# Altium schematic sheet USB_HUB.SchDoc: USB_HUB
size A3; Date: Not used; ApprovedBy: Not used; CheckedBy: Not used; Author: Not used; CompanyName: STMicroelectronics; DrawnBy: Not used; Engineer: Not used; Organization: Not used; Address1: Not used; Address2: Not used; Address3: Not used; Address4: Not used; DocumentNumber: Not used; Revision: Not used; SheetNumber: 12; SheetTotal: 18; CurrentTime: Not used; CurrentDate: Not used; Time: Not used; DocumentFullPathAndName: Not used; DocumentName: Not used; ModifiedDate: Not used; ImagePath: Not used; ProjectName: Not used; Application_BuildNumber: Not used
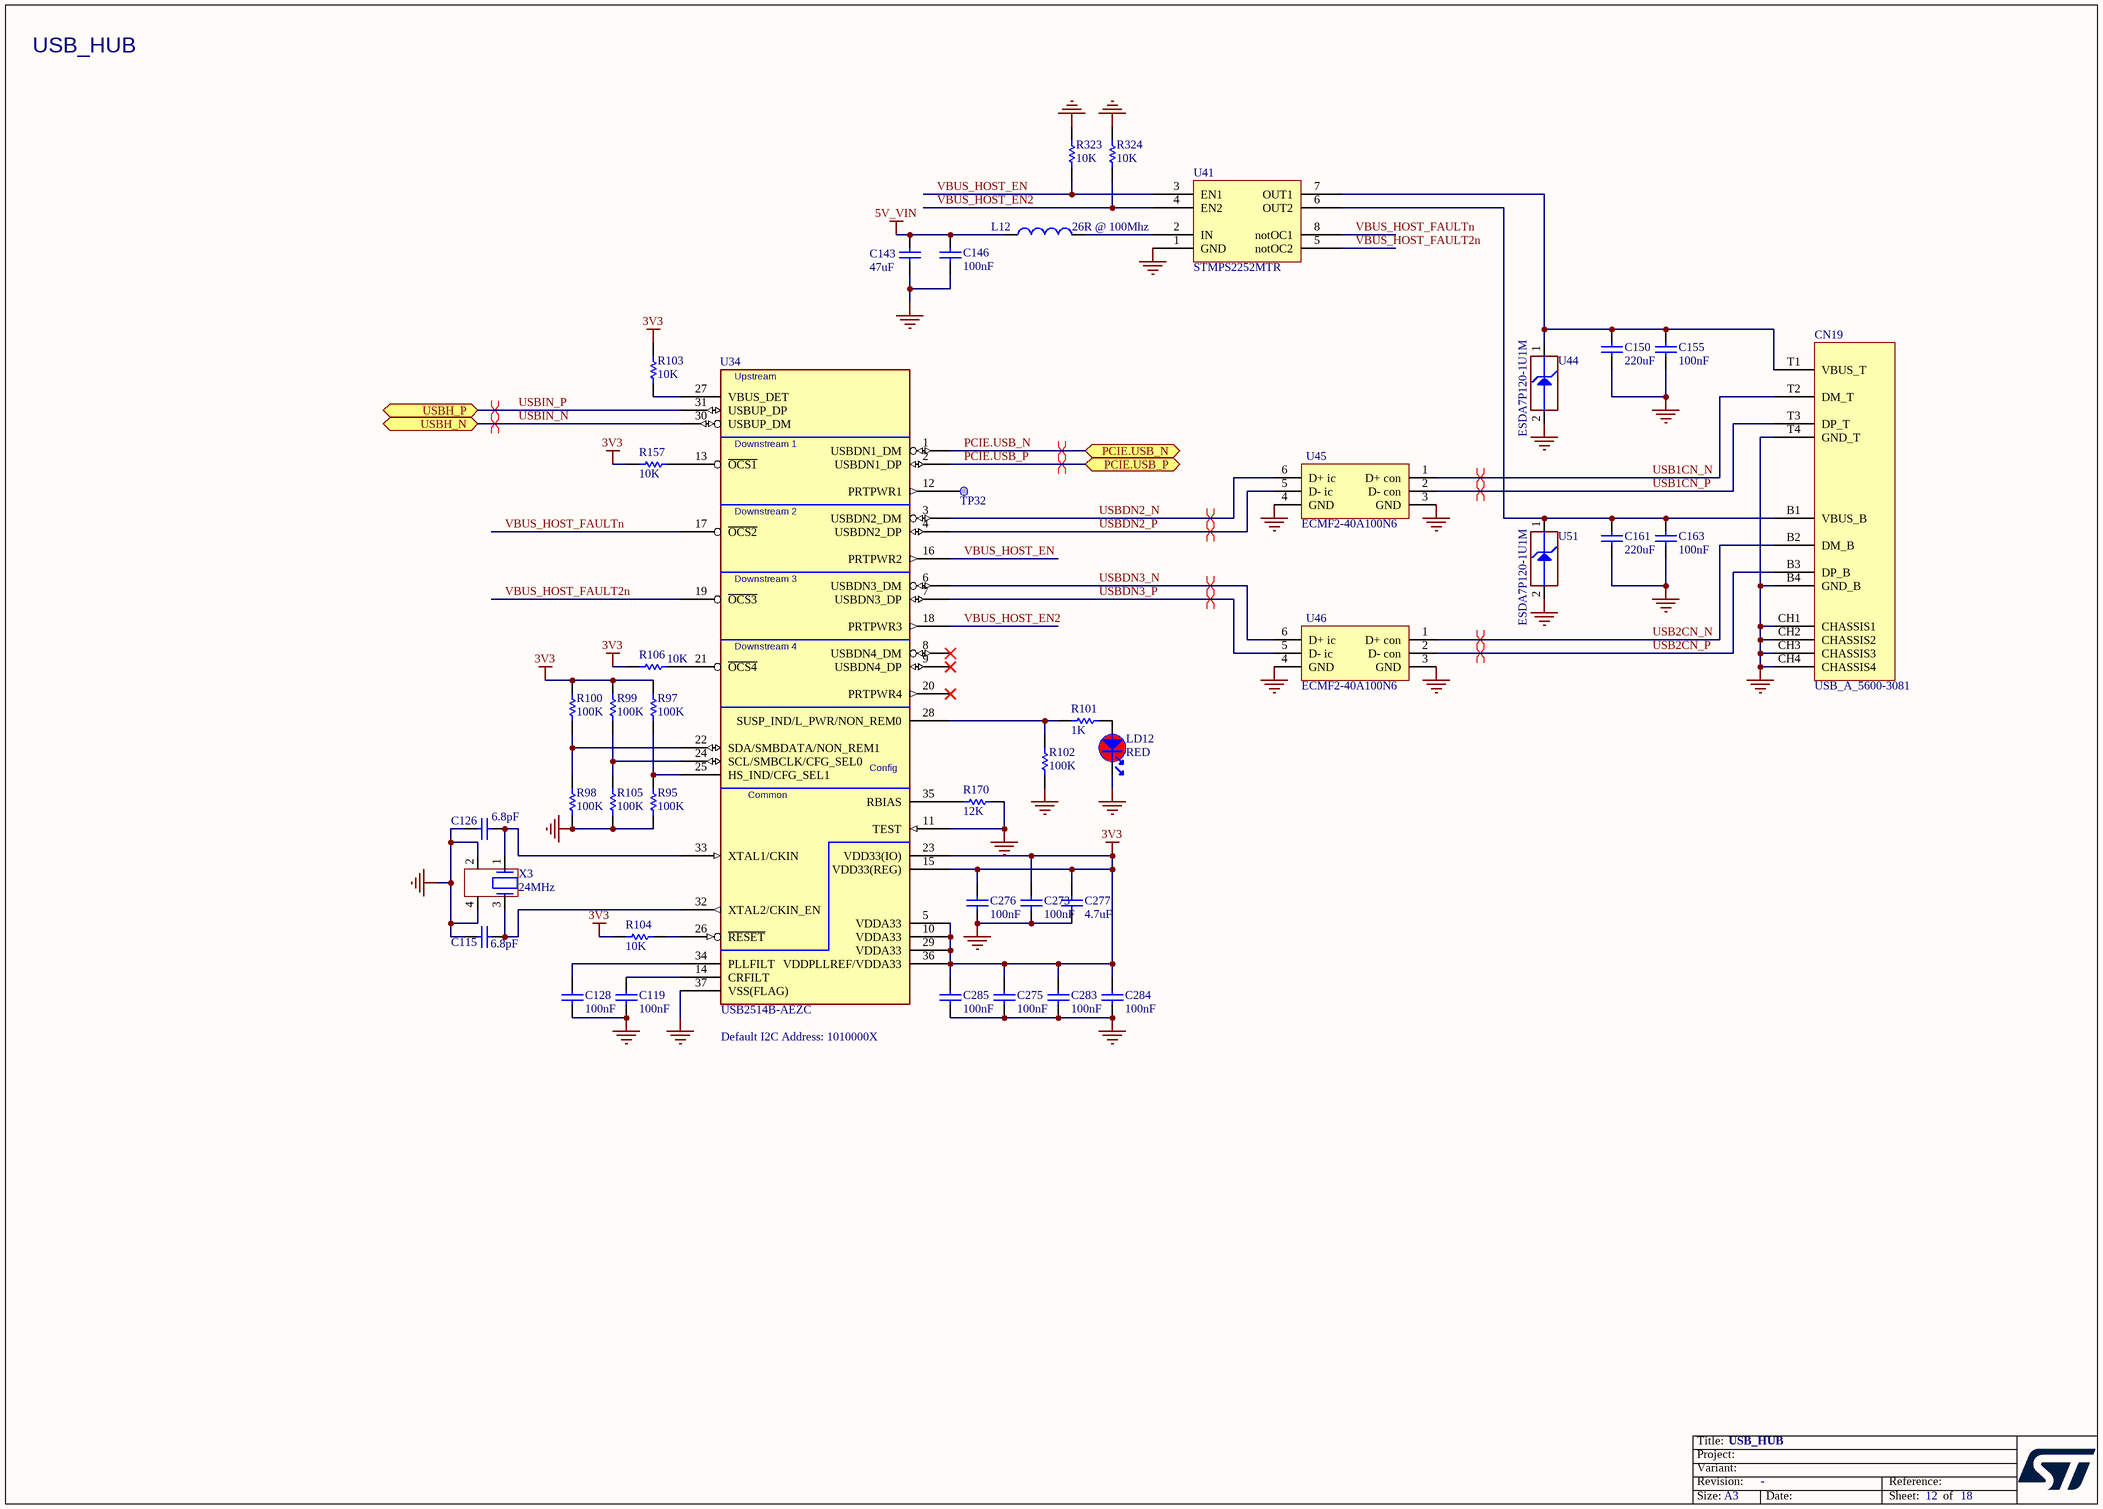
[diagram p0: USB_HUB.SchDoc]

## Parts
C115  value 6.8pF  [C0402]  (hidden comment: Capacitor)
C119  value 100nF  [C0402]  (hidden comment: Capacitor)
C126  value 6.8pF  [C0402]  (hidden comment: Capacitor)
C128  value 100nF  [C0402]  (hidden comment: Capacitor)
C143  value 47uF  [C0805]  (hidden comment: Capacitor)
C146  value 100nF  [C0402]  (hidden comment: Capacitor)
C150  value 220uF  [C1206_H1P6]  (hidden comment: Capacitor)
C155  value 100nF  [C0402]  (hidden comment: Capacitor)
C161  value 220uF  [C1206_H1P6]  (hidden comment: Capacitor)
C163  value 100nF  [C0402]  (hidden comment: Capacitor)
C273  value 100nF  [C0402]  (hidden comment: Capacitor)
C275  value 100nF  [C0402]  (hidden comment: Capacitor)
C276  value 100nF  [C0402]  (hidden comment: Capacitor)
C277  value 4.7uF  [C0402]  (hidden comment: Capacitor)
C283  value 100nF  [C0402]  (hidden comment: Capacitor)
C284  value 100nF  [C0402]  (hidden comment: Capacitor)
C285  value 100nF  [C0402]  (hidden comment: Capacitor)
CN19  value USB_A_5600-3081  [CON_DUAL-USB-TYPE-A_CONEXCON_5600-3081]  (hidden comment: USB_DUAL_TYPEA_5600-3081)
L12  value 26R @ 100Mhz  [FIL_0603_H0P65]  (hidden comment: BEAD)
LD12  value RED  [LED_0603_VISHAY_VLMS1300-GS08_RED_1A2K_H0P8]  (hidden comment: LED_red)
R95  value 100K  [R0402]  (hidden comment: Resistor)
R97  value 100K  [R0402]  (hidden comment: Resistor)
R98  value 100K  [R0402]  (hidden comment: Resistor)
R99  value 100K  [R0402]  (hidden comment: Resistor)
R100  value 100K  [R0402]  (hidden comment: Resistor)
R101  value 1K  [R0402]  (hidden comment: Resistor)
R102  value 100K  [R0402]  (hidden comment: Resistor)
R103  value 10K  [R0402]  (hidden comment: Resistor)
R104  value 10K  [R0402]  (hidden comment: Resistor)
R105  value 100K  [R0402]  (hidden comment: Resistor)
R106  value 10K  [R0402]  (hidden comment: Resistor)
R157  value 10K  [R0402]  (hidden comment: Resistor)
R170  value 12K  [R0402]  (hidden comment: Resistor)
R323  value 10K  [R0402]  (hidden comment: Resistor)
R324  value 10K  [R0402]  (hidden comment: Resistor)
TP32  Test Point  [TP_SMD_1MM]  (value not drawn)  (no BOM)
U34  USB2514B-AEZC  [ICC_QFN36-EPAD_6X6_P050]
U41  STMPS2252MTR  [ICC_SO8_5X4_P127]
U44  value ESDA7P120-1U1M  [ESD_QFN1610_2N_1K_2A]  (hidden comment: ESD-TRANSIL)
U45  ECMF2-40A100N6  [ESD_UQFN-6L_1P45X1P4_P040]
U46  ECMF2-40A100N6  [ESD_UQFN-6L_1P45X1P4_P040]
U51  value ESDA7P120-1U1M  [ESD_QFN1610_2N_1K_2A]  (hidden comment: ESD-TRANSIL)
X3  value 24MHz  [CRY_NX2016SA_4P]  (hidden comment: XTAL_4_PINS)

## Ports
PCIE.USB_N (bidir), PCIE.USB_P (bidir), USBH_N (bidir), USBH_P (bidir)

## Nets
3V3: C273.2 C275.2 C276.2 C277.2 C283.2 C284.2 C285.2 R97.2 R99.2 R100.2 R103.2 R104.1 R106.2 R157.2 U34.5(VDDA33) U34.10(VDDA33) U34.15(VDD33(REG)) U34.23(VDD33(IO)) U34.29(VDDA33) U34.36(VDDPLLREF/VDDA33)
5V_VIN: C143.2 C146.2 L12.1
GND: C115.1 C119.1 C126.1 C128.1 C143.1 C146.1 C150.1 C155.1 C161.1 C163.1 C273.1 C275.1 C276.1 C277.1 C283.1 C284.1 C285.1 CN19.B4(GND_B) CN19.CH1(CHASSIS1) CN19.CH2(CHASSIS2) CN19.CH3(CHASSIS3) CN19.CH4(CHASSIS4) CN19.T4(GND_T) LD12.2 R95.1 R98.1 R102.1 R105.1 R170.1 R323.1 R324.1 U34.11(TEST) U34.37(VSS(FLAG)) U41.1(GND) U44.2(GND) U45.3(GND) U45.4(GND) U46.3(GND) U46.4(GND) U51.2(GND) X3.2 X3.4
PCIE.USB_N: U34.1(USBDN1_DM) ; port PCIE.USB_N
PCIE.USB_P: U34.2(USBDN1_DP) ; port PCIE.USB_P
USB1CN_N: CN19.T2(DM_T) U45.1(D+_con)
USB1CN_P: CN19.T3(DP_T) U45.2(D-_con)
USB2CN_N: CN19.B2(DM_B) U46.1(D+_con)
USB2CN_P: CN19.B3(DP_B) U46.2(D-_con)
USBDN2_N: U34.3(USBDN2_DM) U45.6(D+_ic)
USBDN2_P: U34.4(USBDN2_DP) U45.5(D-_ic)
USBDN3_N: U34.6(USBDN3_DM) U46.6(D+_ic)
USBDN3_P: U34.7(USBDN3_DP) U46.5(D-_ic)
USBIN_N: U34.30(USBUP_DM) ; port USBH_N
USBIN_P: U34.31(USBUP_DP) ; port USBH_P
VBUS_HOST_EN: R323.2 U34.16(PRTPWR2) U41.3(EN1)
VBUS_HOST_EN2: R324.2 U34.18(PRTPWR3) U41.4(EN2)
VBUS_HOST_FAULT2n: U34.19(~{OCS3}) U41.5(notOC2)
VBUS_HOST_FAULTn: U34.17(~{OCS2}) U41.8(notOC1)
NetC115_2: C115.2 U34.32(XTAL2/CKIN_EN) X3.3
NetC119_2: C119.2 U34.14(CRFILT)
NetC126_2: C126.2 U34.33(XTAL1/CKIN) X3.1
NetC128_2: C128.2 U34.34(PLLFILT)
NetC150_2: C150.2 C155.2 CN19.T1(VBUS_T) U41.7(OUT1) U44.1(IO1)
NetC161_2: C161.2 C163.2 CN19.B1(VBUS_B) U41.6(OUT2) U51.1(IO1)
NetL12_2: L12.2 U41.2(IN)
NetLD12_1: LD12.1 R101.1
NetR95_2: R95.2 R97.1 U34.25(HS_IND/CFG_SEL1)
NetR98_2: R98.2 R100.1 U34.22(SDA/SMBDATA/NON_REM1)
NetR99_1: R99.1 R105.2 U34.24(SCL/SMBCLK/CFG_SEL0)
NetR101_2: R101.2 R102.2 U34.28(SUSP_IND/L_PWR/NON_REM0)
NetR103_1: R103.1 U34.27(VBUS_DET)
NetR104_2: R104.2 U34.26(~{RESET})
NetR106_1: R106.1 U34.21(~{OCS4})
NetR157_1: R157.1 U34.13(~{OCS1})
NetR170_2: R170.2 U34.35(RBIAS)
NetTP32_1: TP32.1 U34.12(PRTPWR1)

Not connected (* = marked no-connect by the designer): U34 8(USBDN4_DM)* 9(USBDN4_DP)* 20(PRTPWR4)*

## Layout directives
differential pair: PCIE.USB_N, PCIE.USB_P, USB1CN_N, USB1CN_P, USB2CN_N, USB2CN_P, USBDN2_N, USBDN2_P, USBDN3_N, USBDN3_P, USBIN_N, USBIN_P

## Notes on the sheet
- USB_HUB
- Default I2C Address: 1010000X
- Title:
- Project:
- Size:
- Revision:
- Variant:
- A3
- -
- Date:
- Reference:
- Sheet:
- of
- (in symbol MCD-00145) Upstream; Downstream 1; Downstream 2; Downstream 3; Downstream 4; Config; Common

## Library data of the parts
C115 C126 = MCD-00674: Capacitor, MLCC, 6.8pF, 50V, NPO, +/-0.25pF, 0402, T=0.5mm; Manufacturer_Part_Number: CC0402CRNPO9BN6R8; Manufacturer: YAGEO; Part_Preference: Recommended; Component_Country_Of_Origin: China; ID: 3068; ShowFields: YES; Internal_Part_Number: MCD-00674; Status: Released; Part_Type: Capacitor; Package: 0402; ComponentLink1URL: http://tunmcdsvn.tun.st.com/Component_Documentation_Library/Trunk/Capacitor/YAGEO_NP0_Series; Order_Code_Digikey: 311-3327-1-ND; Order_Code_Farnell: N/A; Order_Code_RS: N/A
C119 C128 C146 C155 C163 C273 C275 C276 C283-C285 = MCD-00006: Capacitor, MLCC, 100nF, 16V, X7R, +/-10%, 0402, T=0.5mm; Manufacturer_Part_Number: CC0402KRX7R7BB104; Manufacturer: YAGEO; Part_Preference: Recommended; Order_Code_RS: 616-9701; Component_Country_Of_Origin: China; ID: 2474; ShowFields: YES; Internal_Part_Number: MCD-00006; Status: Released; Part_Type: Capacitor; Package: 0402; ComponentLink1URL: http://tunmcdsvn.tun.st.com/Component_Documentation_Library/Trunk/Capacitor/YAGEO_X7R_Series; Order_Code_Digikey: 311-1338-1-ND; Order_Code_Farnell: 9402047
C143 = MCD-00204: Capacitor, MLCC, 47uF, 10V, X5R, +/-20%, 0805, T=1.25mm; Part_Preference: Recommended; Manufacturer: MURATA; Manufacturer_Part_Number: GRM21BR61A476ME15K; Component_Country_Of_Origin: Japan; ShowFields: YES; ID: 2664; Internal_Part_Number: MCD-00204; Status: Checked; Part_Type: Capacitor; Package: 0805; ComponentLink1URL: http://tunmcdsvn.tun.st.com/Component_Documentation_Library/Trunk/Capacitor/MURATA_GRM_Series; Order_Code_Digikey: GRM21BR61A476ME15K-ND; Order_Code_Farnell: N/A; Order_Code_RS: N/A
C150 C161 = MCD-00104: Capacitor, MLCC, 220uF, 6V3, X5R, +/-20%, 1206, T=1.6mm; Manufacturer_Part_Number: GRM31CR60J227ME11; Manufacturer: MURATA; Part_Preference: Recommended; Order_Code_RS: 170-6396; Component_Country_Of_Origin: Japan; ID: 2764; ShowFields: YES; Internal_Part_Number: MCD-00104; Status: Released; Part_Type: Capacitor; Package: 1206; ComponentLink1URL: http://tunmcdsvn.tun.st.com/Component_Documentation_Library/Trunk/Capacitor/MURATA_GRM_Series; Order_Code_Digikey: 490-13970-1-ND; Order_Code_Farnell: 2494472
C277 = MCD-01356: Capacitor, MLCC, 4.7uF, 6V3, X5R, +/-20%, 0402, T=0.5mm; Manufacturer_Part_Number: GRM155R60J475ME47; Manufacturer: MURATA; Part_Preference: Recommended; Order_Code_RS: 814-5230; Component_Country_Of_Origin: Japan; ID: 3456; ShowFields: YES; Internal_Part_Number: MCD-01356; Status: Released; Part_Type: Capacitor; Package: 0402; ComponentLink1URL: http://tunmcdsvn.tun.st.com/Component_Documentation_Library/Trunk/Capacitor/MURATA_GRM_Series; Order_Code_Digikey: 490-5915-1-ND; Order_Code_Farnell: 2666407
CN19 = MCD-00109: USB_Dual-TypeA, Receptacle, 8pins, 2.5mm, RA, TH, T= 15.5mm; Manufacturer: CONEXCON; Part_Type: Connector; Part_Preference: Recommended; Component_Country_Of_Origin: Unknown; ID: 2756; ShowFields: YES; Internal_Part_Number: MCD-00109; Manufacturer_Part_Number: 5600-3081; Status: Released; ComponentLink1URL: http://tunmcdsvn.tun.st.com/Component_Documentation_Library/Trunk/Connector/CONEXCON_5600_Series/; Order_Code_Digikey: N/A; Order_Code_Farnell: N/A; Order_Code_RS: N/A
L12 = MCD-00305: Ferrite bead, 26R @ 100Mhz, +/-25%, 6000mA, 0R007, 0603, T=0.75mm; Manufacturer_Part_Number: BLM18KG260TN1; Manufacturer: MURATA; Part_Type: Inductor; Part_Preference: Recommended; Order_Code_RS: 747-4723; Component_Country_Of_Origin: Japan; ID: 2564; ShowFields: YES; Internal_Part_Number: MCD-00305; Status: Checked; ComponentLink1URL: http://tunmcdsvn.tun.st.com/Component_Documentation_Library/Trunk/Inductor/MURATA_BLM_Series; Order_Code_Digikey: 490-5252-2-ND; Order_Code_Farnell: 1781087; Package: 0603
LD12 = MCD-00587: LED Red, 0603 SMD, 2V Forward Voltage; Part_Type: Display; Manufacturer_Part_Number: VLMS1300-GS08; Manufacturer: VISHAY; Alternate_Manufacturer_Part_Number: LS Q976-NR-1; Alternate_Manufacturer: OSRAM OPTO SEMICONDUCTORS; Alternate_Internal_Part_Number: MCD-02401; Part_Preference: Recommended; Provided_By: SUBCO; Component_Country_Of_Origin: China; ID: 3154; ShowFields: YES; Internal_Part_Number: MCD-00587; Status: Released; Package: LED 0603; ComponentLink1Description: Datasheet; ComponentLink1URL: http://tunmcdsvn.tun.st.com/Component_Datasheet_Library/Trunk/Display/VISHAY_LED_RED_VLMS1300-GS08; Order_Code_Digikey: VLMS1300-GS08CT-ND; Order_Code_Farnell: 2078728; ECCN_US: n/a; ECCN_EU: n/a
R95 R97-R100 R102 R105 = MCD-00059: Resistor, 100K, 0402, +/-1%, 1/16W; Manufacturer_Part_Number: RC0402FR-07100KL; Manufacturer: YAGEO; Part_Preference: Recommended; Component_Country_Of_Origin: China; ID: 2533; ShowFields: YES; Internal_Part_Number: MCD-00059; Status: Released; Part_Type: Resistor; ComponentLink1URL: http://tunmcdsvn.tun.st.com/Component_Documentation_Library/Trunk/Resistor/YAGEO_RC_L_Series; Package: 0402; Order_Code_Digikey: 311-100KLRTR-ND; Order_Code_Farnell: 2421891; Order_Code_RS: N/A
R101 = MCD-00061: Resistor, 1K, 0402, +/-1%,1/16W; Manufacturer_Part_Number: RC0402FR-071KL; Manufacturer: YAGEO; Part_Preference: Recommended; Component_Country_Of_Origin: China; ID: 2532; ShowFields: YES; Internal_Part_Number: MCD-00061; Status: Released; Part_Type: Resistor; ComponentLink1URL: http://tunmcdsvn.tun.st.com/Component_Documentation_Library/Trunk/Resistor/YAGEO_RC_L_Series; Package: 0402; Order_Code_Digikey: 311-1.00KLRCT-ND; Order_Code_Farnell: 9239235; Order_Code_RS: N/A
R103 R104 R106 R157 R323 R324 = MCD-00053: Resistor, 10K, 0402, +/-1%, 1/16W; Manufacturer_Part_Number: RC0402FR-0710KL; Manufacturer: YAGEO; BMS_Part_Number: 9131590; Part_Preference: Recommended; Component_Country_Of_Origin: China; ID: 2539; ShowFields: YES; Internal_Part_Number: MCD-00053; Status: Released; Part_Type: Resistor; ComponentLink1URL: http://tunmcdsvn.tun.st.com/Component_Documentation_Library/Trunk/Resistor/YAGEO_RC_L_Series; Package: 0402; Order_Code_Digikey: 311-10.0KLRCT-ND; Order_Code_Farnell: 9239359; Order_Code_RS: N/A
R170 = MCD-00187: Resistor, 12K, 0402, +/-1%, 1/16W; Manufacturer_Part_Number: RC0402FR-0712KL; Manufacturer: YAGEO; BMS_Part_Number: 9131030; Part_Preference: Recommended; Component_Country_Of_Origin: China; ID: 2678; ShowFields: YES; Internal_Part_Number: MCD-00187; Status: Released; Part_Type: Resistor; ComponentLink1URL: http://tunmcdsvn.tun.st.com/Component_Documentation_Library/Trunk/Resistor/YAGEO_RC_L_Series; Package: 0402; Order_Code_Digikey: 311-12.0KLRCT-ND; Order_Code_Farnell: 9239367; Order_Code_RS: N/A
TP32 = MCD-00074: Test Point 1mm; Part_Type: Misc; Part_Preference: Recommended; ID: 2518; ShowFields: YES; Internal_Part_Number: MCD-00074; Status: Released; Manufacturer_Part_Number: n/a; Manufacturer: n/a; ComponentLink1URL: http://na; Order_Code_Digikey: N/A; Order_Code_Farnell: N/A; Order_Code_RS: N/A
U34 = MCD-00145: USB HUB 2,0 Controller; Manufacturer: MICROCHIP; Part_Type: IC; Part_Preference: Recommended; Component_Country_Of_Origin: Unknown; ID: 2724; ShowFields: YES; Value: USB2514B-AEZC; Internal_Part_Number: MCD-00145; Manufacturer_Part_Number: USB2514B-AEZC; Status: Released; ComponentLink1URL: http://tunmcdsvn.tun.st.com/Component_Datasheet_Library/Trunk/IC/Microchip_HS Hub Controller_USB2514B-AEZC; Order_Code_Digikey: N/A; Order_Code_Farnell: N/A; Order_Code_RS: N/A
U41 = MCD-00123: IC,Dual-Channel-Power-Switch,500mA,100mR,SO8; Manufacturer: STMICROELECTRONICS; BMS_Part_Number: 9159012; Part_Preference: Recommended; Manufacturer_HQ_COO: EU; Component_Country_Of_Origin: China; ID: 2746; ShowFields: YES; Value: STMPS2252MTR; Internal_Part_Number: MCD-00123; Manufacturer_Part_Number: STMPS2252MTR; Status: Released; Part_Type: IC; ComponentLink1URL: http://tunmcdsvn.tun.st.com/Component_Datasheet_Library/Trunk/IC/STM_PWR_switch_STMPS2252MTR; Order_Code_Digikey: N/A; Order_Code_Farnell: N/A; Order_Code_RS: N/A
U44 U51 = MCD-01026: High power transient voltage suppressor; Part_Type: Diode; Manufacturer: STMICROELECTRONICS; BMS_Part_Number: 9179046; Part_Preference: Recommended; Manufacturer_HQ_COO: EU; Component_Country_Of_Origin: China; ID: 2997; ShowFields: YES; Internal_Part_Number: MCD-01026; Status: Released; Manufacturer_Part_Number: ESDA7P120-1U1M; Package: QFN1610; ComponentLink1URL: http://tunmcdsvn.tun.st.com/Component_Datasheet_Library/Trunk/Diodes/STM_ESD_ESDA7P120-1U1M
U45 U46 = MCD-03060: ESD protection & Common Filter High Speed serial Interfaces , 0.4 pitch; Part_Type: IC; Part_Preference: Recommended; Manufacturer: STMICROELECTRONICS; ShowFields: YES; ID: 5176; Component_Country_Of_Origin: China; ComponentLink1Description: Datasheet; ComponentLink1URL: http://tunmcdsvn.tun.st.com/Component_Documentation_Library/Trunk/IC/STMICROELECTRONICS_ECMF4-40A100N10; Internal_Part_Number: MCD-03060; Value: ECMF2-40A100N6; Status: Checked; Manufacturer_Part_Number: ECMF2-40A100N6; Package: uQFN-6; Order_Code_Digikey: 497-ECMF2-40A100N6; Order_Code_Farnell: 3993603; Order_Code_RS: N/A
X3 = MCD-01036: Crystal, 24MHz, 6pF, +/-20ppm, 80R, 2x1.6mm; Part_Type: Crystal_Osc; Manufacturer_Part_Number: NX2016SA-24MHZ-EXS00A-CS10820; Manufacturer: NDK; BMS_Part_Number: 9157045; Part_Preference: Recommended; Component_Country_Of_Origin: Unknown; ID: 2989; ShowFields: YES; Internal_Part_Number: MCD-01036; Status: Released; Package: 2x1.6mm; ComponentLink1URL: http://tunmcdsvn.tun.st.com/Component_Documentation_Library/Trunk/Crytal_Oscillator/NDK_NX2016SA_Series; Order_Code_Digikey: 644-1365; Order_Code_Farnell: N/A; Order_Code_RS: N/A